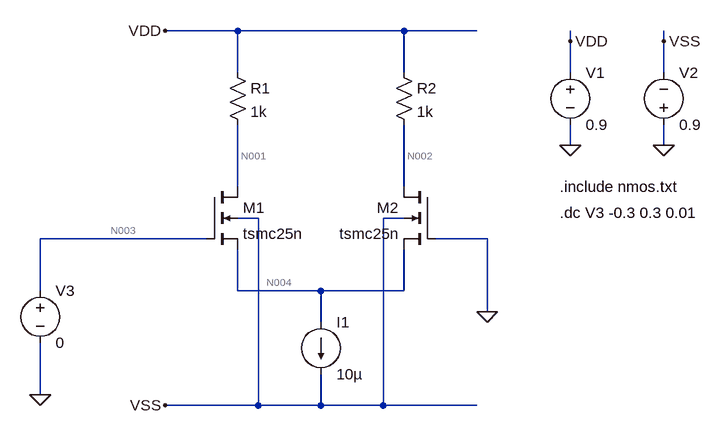
[diagram p0: schematic HW2_1.asc]
HW2_1.asc, the LTspice schematic file:
Version 4
SHEET 1 924 680
WIRE 0 -208 -112 -208
WIRE 256 -208 0 -208
WIRE 368 -208 256 -208
WIRE 512 -192 512 -208
WIRE 656 -192 656 -208
WIRE 0 -144 0 -208
WIRE 256 -144 256 -208
WIRE 512 -144 512 -192
WIRE 656 -144 656 -192
WIRE 512 -32 512 -64
WIRE 656 -32 656 -64
WIRE 0 32 0 -64
WIRE 256 32 256 -64
WIRE 32 80 0 80
WIRE 256 80 224 80
WIRE -48 112 -304 112
WIRE 384 112 304 112
WIRE -304 192 -304 112
WIRE 0 192 0 128
WIRE 128 192 0 192
WIRE 256 192 256 128
WIRE 256 192 128 192
WIRE 384 224 384 112
WIRE 128 240 128 192
WIRE -304 352 -304 272
WIRE 32 368 32 80
WIRE 32 368 -112 368
WIRE 128 368 128 320
WIRE 128 368 32 368
WIRE 224 368 224 80
WIRE 224 368 128 368
WIRE 368 368 224 368
FLAG -112 -208 VDD
FLAG -112 368 VSS
FLAG 512 -32 0
FLAG 512 -192 VDD
FLAG 656 -32 0
FLAG 656 -192 VSS
FLAG 384 224 0
FLAG -304 352 0
SYMBOL res -16 -160 R0
SYMATTR InstName R1
SYMATTR Value 1k
SYMBOL res 240 -160 R0
SYMATTR InstName R2
SYMATTR Value 1k
SYMBOL nmos4 -48 32 R0
SYMATTR InstName M1
SYMATTR Value tsmc25n
SYMATTR Value2 l=2.4u w=9.6u
SYMBOL nmos4 304 32 M0
SYMATTR InstName M2
SYMATTR Value tsmc25n
SYMATTR Value2 l=2.4u w=9.6u
SYMBOL current 128 240 R0
WINDOW 123 0 0 Left 0
WINDOW 39 0 0 Left 0
SYMATTR InstName I1
SYMATTR Value 10µ
SYMBOL voltage 512 -160 R0
WINDOW 123 0 0 Left 0
WINDOW 39 0 0 Left 0
SYMATTR InstName V1
SYMATTR Value 0.9
SYMBOL voltage 656 -48 M180
WINDOW 0 24 96 Left 2
WINDOW 3 24 16 Left 2
WINDOW 123 0 0 Left 0
WINDOW 39 0 0 Left 0
SYMATTR InstName V2
SYMATTR Value 0.9
SYMBOL voltage -304 176 R0
WINDOW 123 0 0 Left 0
WINDOW 39 0 0 Left 0
SYMATTR InstName V3
SYMATTR Value 0
TEXT 496 32 Left 2 !.include nmos.txt
TEXT 496 72 Left 2 !.dc V3 -0.3 0.3 0.01

The netlist it stands for:
* HW2_1.asc
R1 VDD N001 1k
R2 VDD N002 1k
M1 N001 N003 N004 VSS tsmc25n l=2.4u w=9.6u
M2 N002 0 N004 VSS tsmc25n l=2.4u w=9.6u
I1 N004 VSS 10µ
V1 VDD 0 0.9
V2 0 VSS 0.9
V3 N003 0 0
.model NMOS NMOS
.model PMOS PMOS
.lib standard.mos
.include nmos.txt
.dc V3 -0.3 0.3 0.01
.backanno
.end

* Results of the author's LTspice run, read from the files saved beside the schematic
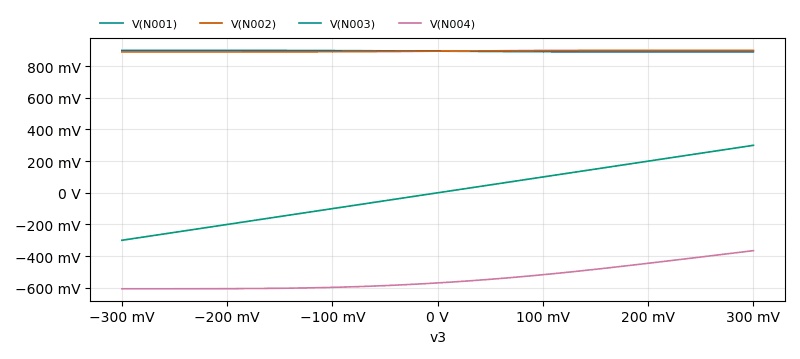
[diagram p1: DC transfer characteristic of HW2_1.asc, plotted from the saved traces]
* DC transfer characteristic, 1 run:
*   V(N001): 900 mV at v3=-300 mV, 890 mV at v3=300 mV, min 890 mV, max 900 mV
*   V(N002): 890 mV at v3=-300 mV, 900 mV at v3=300 mV, min 890 mV, max 900 mV
*   V(N003): -300 mV at v3=-300 mV, 300 mV at v3=300 mV, min -300 mV, max 300 mV
*   V(N004): -606.6 mV at v3=-300 mV, -365.5 mV at v3=300 mV, min -606.6 mV, max -365.5 mV